# Altium schematic sheet Gates.SchDoc: Gates
size A4; CompanyName: TM; DrawnBy: Juan Tinazzo; DocumentNumber: 2; SheetNumber: 2; SheetTotal: 3; Number: DRV-GTS
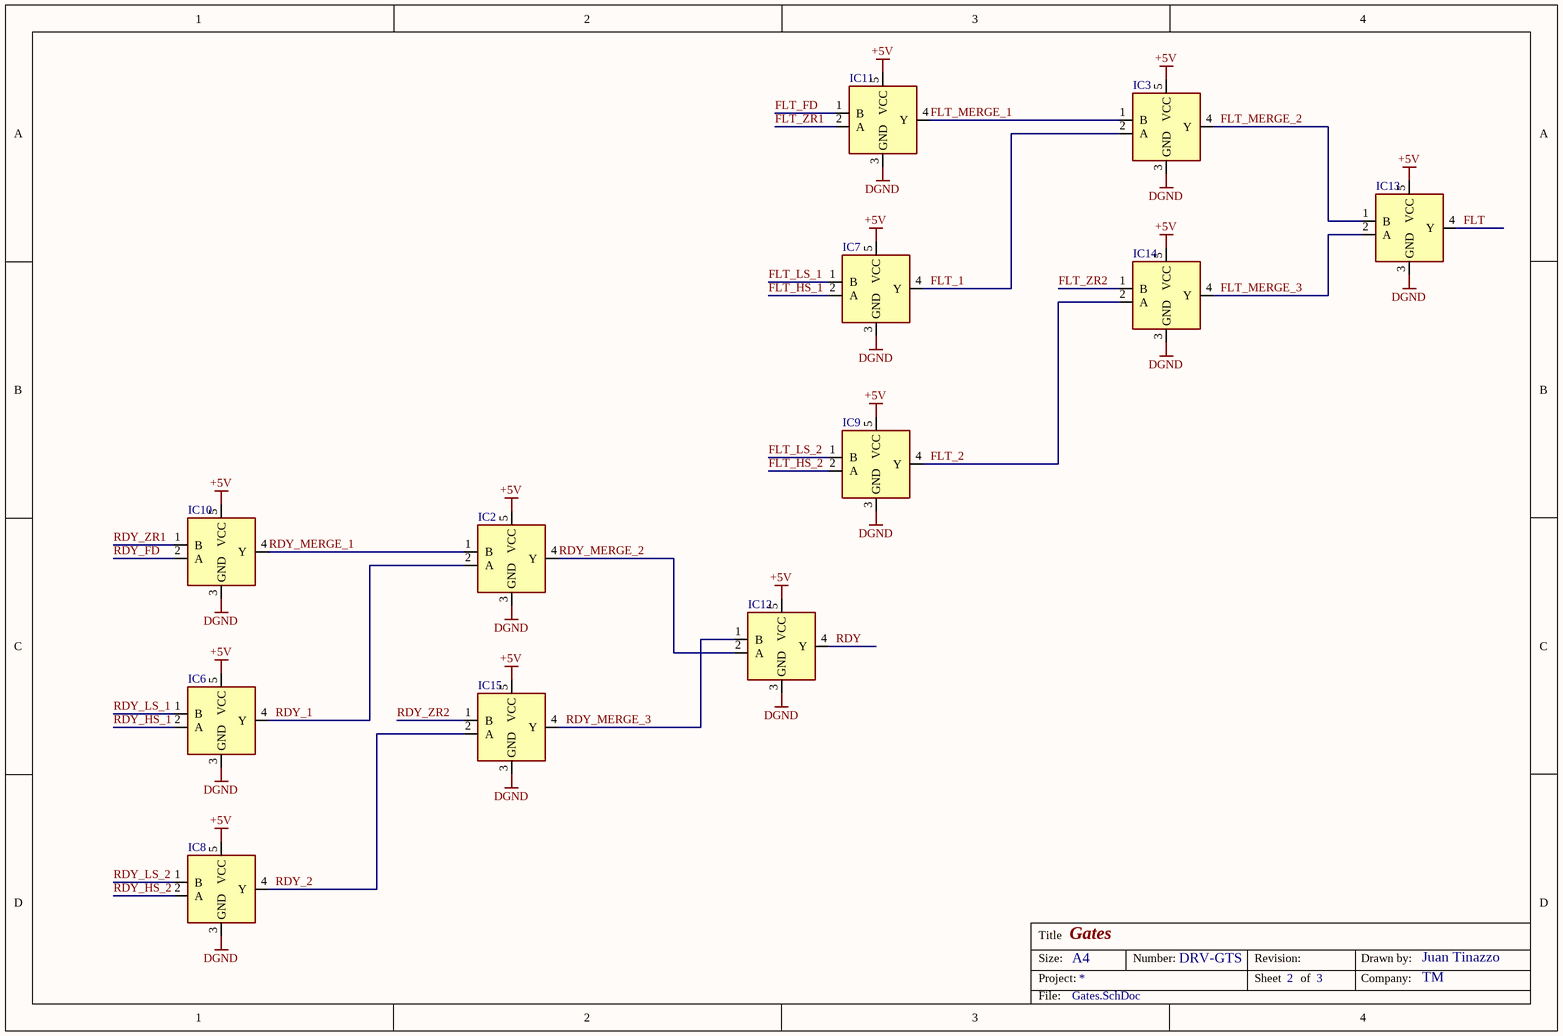
[diagram p0: Gates.SchDoc]

## Parts
IC2  74LVC1G08GW,125  [SOT65P210X110-5N]  (value not drawn)
IC3  74LVC1G08GW,125  [SOT65P210X110-5N]  (value not drawn)
IC6  74LVC1G08GW,125  [SOT65P210X110-5N]  (value not drawn)
IC7  74LVC1G08GW,125  [SOT65P210X110-5N]  (value not drawn)
IC8  74LVC1G08GW,125  [SOT65P210X110-5N]  (value not drawn)
IC9  74LVC1G08GW,125  [SOT65P210X110-5N]  (value not drawn)
IC10  74LVC1G08GW,125  [SOT65P210X110-5N]  (value not drawn)
IC11  74LVC1G08GW,125  [SOT65P210X110-5N]  (value not drawn)
IC12  74LVC1G08GW,125  [SOT65P210X110-5N]  (value not drawn)
IC13  74LVC1G08GW,125  [SOT65P210X110-5N]  (value not drawn)
IC14  74LVC1G08GW,125  [SOT65P210X110-5N]  (value not drawn)
IC15  74LVC1G08GW,125  [SOT65P210X110-5N]  (value not drawn)

## Nets
+5V: IC2.5(VCC) IC3.5(VCC) IC6.5(VCC) IC7.5(VCC) IC8.5(VCC) IC9.5(VCC) IC10.5(VCC) IC11.5(VCC) IC12.5(VCC) IC13.5(VCC) IC14.5(VCC) IC15.5(VCC)
DGND: IC2.3(GND) IC3.3(GND) IC6.3(GND) IC7.3(GND) IC8.3(GND) IC9.3(GND) IC10.3(GND) IC11.3(GND) IC12.3(GND) IC13.3(GND) IC14.3(GND) IC15.3(GND)
FLT: IC13.4(Y)
FLT_1: IC3.2(A) IC7.4(Y)
FLT_2: IC9.4(Y) IC14.2(A)
FLT_FD: IC11.1(B)
FLT_HS_1: IC7.2(A)
FLT_HS_2: IC9.2(A)
FLT_LS_1: IC7.1(B)
FLT_LS_2: IC9.1(B)
FLT_MERGE_1: IC3.1(B) IC11.4(Y)
FLT_MERGE_2: IC3.4(Y) IC13.1(B)
FLT_MERGE_3: IC13.2(A) IC14.4(Y)
FLT_ZR1: IC11.2(A)
FLT_ZR2: IC14.1(B)
RDY: IC12.4(Y)
RDY_1: IC2.2(A) IC6.4(Y)
RDY_2: IC8.4(Y) IC15.2(A)
RDY_FD: IC10.2(A)
RDY_HS_1: IC6.2(A)
RDY_HS_2: IC8.2(A)
RDY_LS_1: IC6.1(B)
RDY_LS_2: IC8.1(B)
RDY_MERGE_1: IC2.1(B) IC10.4(Y)
RDY_MERGE_2: IC2.4(Y) IC12.2(A)
RDY_MERGE_3: IC12.1(B) IC15.4(Y)
RDY_ZR1: IC10.1(B)
RDY_ZR2: IC15.1(B)

## Notes on the sheet
- Title
- Size:
- Project:
- A4
- Number:
- Revision:
- Sheet
- of
- Drawn by:
- Company:
- File:

## Library data of the parts
IC2 IC3 IC6-IC15 = 74LVC1G08GW,125: Integrated Circuit; Manufacturer_Name: Nexperia; Value: Compuertas AND - 1 compuerta 2 entradas; Datasheet Link: https://assets.nexperia.com/documents/data-sheet/74LVC1G08.pdf; Height: 1.1mm; Manufacturer_Part_Number: 74LVC1G08GW,125; Mouser Part Number: 771-74LVC1G08GW-G; Mouser Price/Stock: https://www.mouser.co.uk/ProductDetail/Nexperia/74LVC1G08GW125?qs=me8TqzrmIYVtW9TtT8QUhw%3D%3D; Arrow Part Number: 74LVC1G08GW,125; Arrow Price/Stock: https://www.arrow.com/en/products/74lvc1g08gw125/nexperia?region=nac